# EAGLE design untitled (EAGLE 9.6.1)
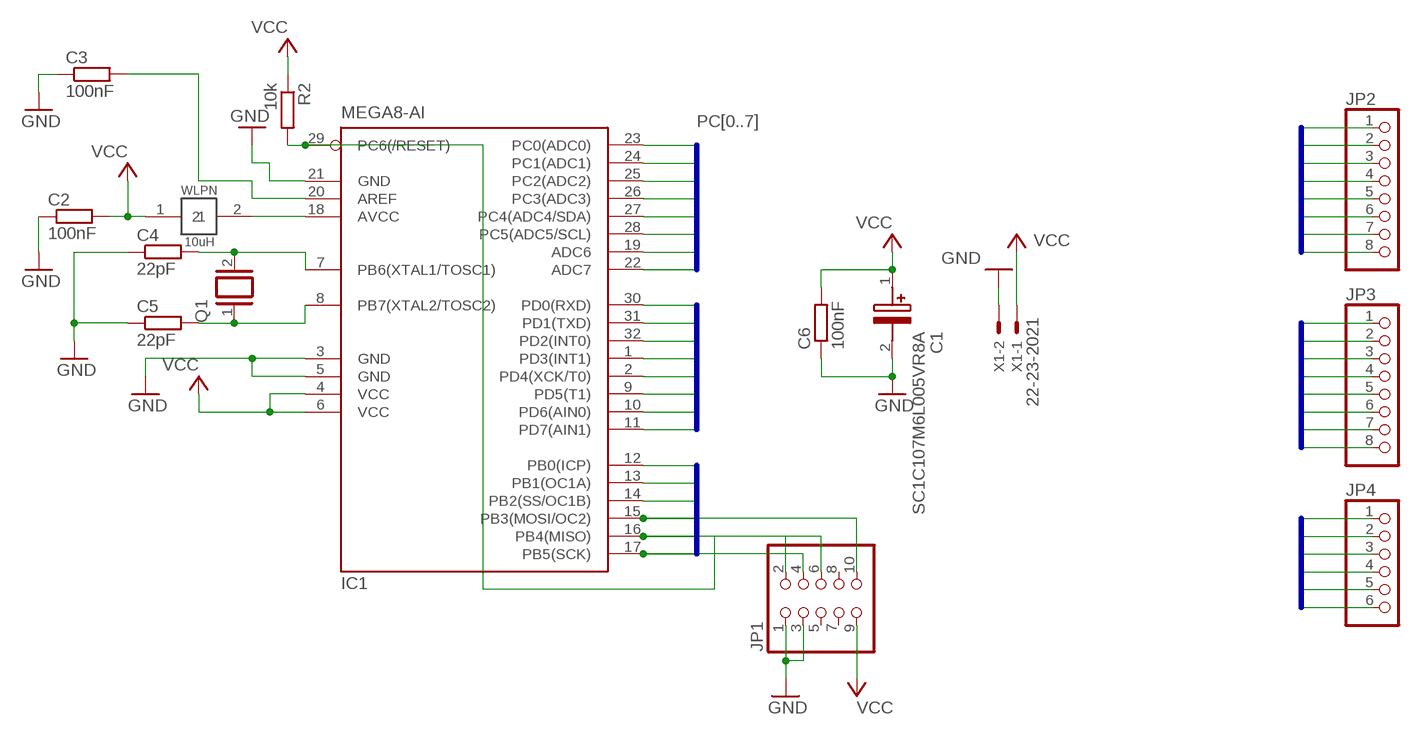
[diagram p0: schematic, sheet 1]

## Parts
C1  SC1C107M6L005VR8A  [CAPAE660X560N]
C2  100nF  R-EU_R0805  [R0805]
C3  100nF  R-EU_R0805  [R0805]
C4  22pF  R-EU_R0805  [R0805]
C5  22pF  R-EU_R0805  [R0805]
C6  100nF  R-EU_R0805  [R0805]
IC1  MEGA8-AI  [TQFP32-08]
JP1  PINHD-2X5  [2X05]
JP2  PINHD-1X8  [1X08]
JP3  PINHD-1X8  [1X08]
JP4  PINHD-1X6  [1X06]
Q1  XTAL/S  [QS]
R2  10k  R-EU_R0805  [R0805]
WLPN  10uH  WLPN303015M100PBSMD  [WLPN303015M100PB]
X1  22-23-2021  [22-23-2021]

## Nets
GND: C1.2(-) C2.1 C3.1 C4.1 C5.1 C6.1 IC1.3(GND) IC1.5(GND) IC1.21(GND) JP1.1 JP1.3 X1.2
N$1: IC1.29(PC6(/RESET)) JP1.6 R2.2
N$2: IC1.18(AVCC) WLPN.2
N$3: C3.2 IC1.20(AREF)
N$4: C4.2 IC1.7(PB6(XTAL1/TOSC1)) Q1.2
N$5: C5.2 IC1.8(PB7(XTAL2/TOSC2)) Q1.1
PB0: IC1.12(PB0(ICP)) JP4.1
PB1: IC1.13(PB1(OC1A)) JP4.2
PB2: IC1.14(PB2(SS/OC1B)) JP4.3
PB3: IC1.15(PB3(MOSI/OC2)) JP1.10 JP4.4
PB4: IC1.16(PB4(MISO)) JP1.2 JP4.5
PB5: IC1.17(PB5(SCK)) JP1.4 JP4.6
PC0: IC1.23(PC0(ADC0)) JP2.1
PC1: IC1.24(PC1(ADC1)) JP2.2
PC2: IC1.25(PC2(ADC2)) JP2.3
PC3: IC1.26(PC3(ADC3)) JP2.4
PC4: IC1.27(PC4(ADC4/SDA)) JP2.5
PC5: IC1.28(PC5(ADC5/SCL)) JP2.6
PC6: IC1.19(ADC6) JP2.7
PC7: IC1.22(ADC7) JP2.8
PD0: IC1.30(PD0(RXD)) JP3.1
PD1: IC1.31(PD1(TXD)) JP3.2
PD2: IC1.32(PD2(INT0)) JP3.3
PD3: IC1.1(PD3(INT1)) JP3.4
PD4: IC1.2(PD4(XCK/T0)) JP3.5
PD5: IC1.9(PD5(T1)) JP3.6
PD6: IC1.10(PD6(AIN0)) JP3.7
PD7: IC1.11(PD7(AIN1)) JP3.8
VCC: C1.1(+) C2.2 C6.2 IC1.4(VCC) IC1.6(VCC) JP1.9 R2.1 WLPN.1 X1.1
Unconnected: JP1.5 JP1.7 JP1.8

## Buses
PC[0..7]
PD[0..7]
PB[0..5]

## Library data of the parts
C1 = SamacSys_Parts:SC1C107M6L005VR8A: SURFACE MOUNT ALUMINUM ELECTROLYTIC CAPACITOR Source: Datasheet <https://store.comet.bg/download-file.php?id=10409>; DESCRIPTION: SURFACE MOUNT ALUMINUM ELECTROLYTIC CAPACITOR; HEIGHT: 5.6mm; MANUFACTURER_NAME: Samwha Capacitor; MANUFACTURER_PART_NUMBER: SC1C107M6L005VR8A
C2-C6 R2 = rcl:R-EU_: RESISTOR, European symbol; SPICEPREFIX: R
IC1 = atmel:MEGA8: MICROCONTROLLER 8 Kbytes FLASH, 1 kbytes SRAM, 512 bytes EEPROM, USART, 6-channel 10 bit ADC, 2-channel 8 bit ADC Pin compatible with Atmega48, ATMega88, ATMega168 Source: avr.lbr; MPN: ATMEGA8-16AU; OC_FARNELL: 9171371; OC_NEWARK: 73M8863
JP1 = pinhead:PINHD-2X5: PIN HEADER
JP2 JP3 = pinhead:PINHD-1X8: PIN HEADER
JP4 = pinhead:PINHD-1X6: PIN HEADER
Q1 = special:XTAL/S: CRYSTAL
WLPN = WLPN303015M100PB:WLPN303015M100PB
X1 = con-molex:22-23-2021: .100" (2.54mm) Center Header - 2 Pin; MF: MOLEX; MPN: 22-23-2021; OC_FARNELL: 1462926; OC_NEWARK: 25C3832

## Board
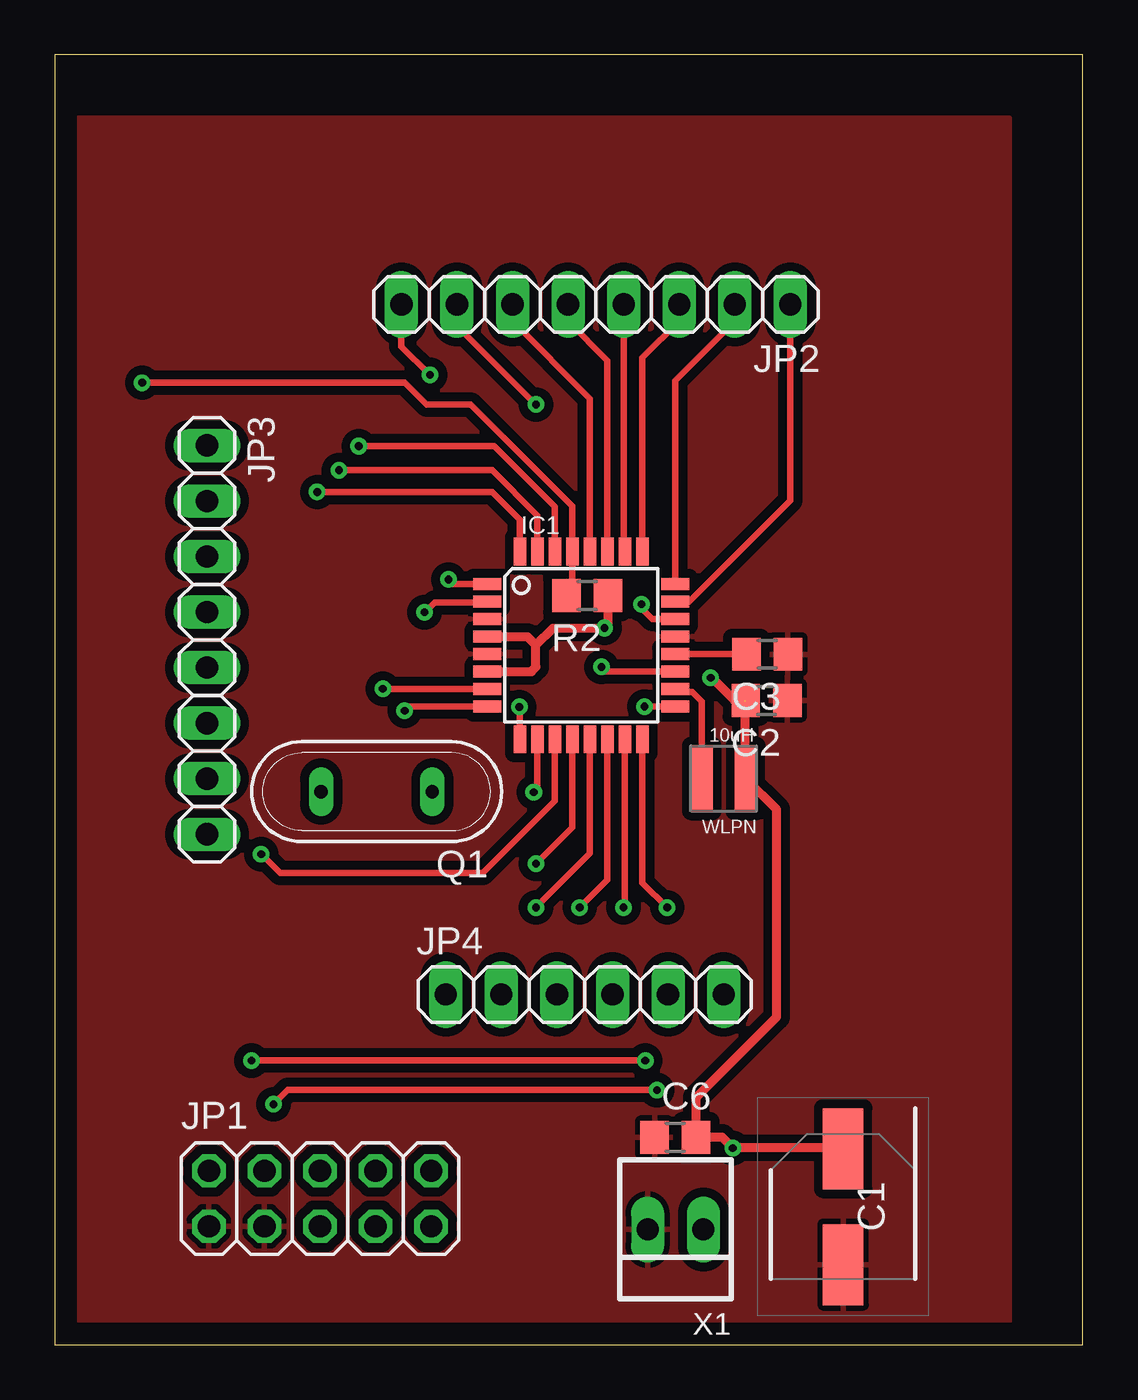
[diagram p1: board, top side]
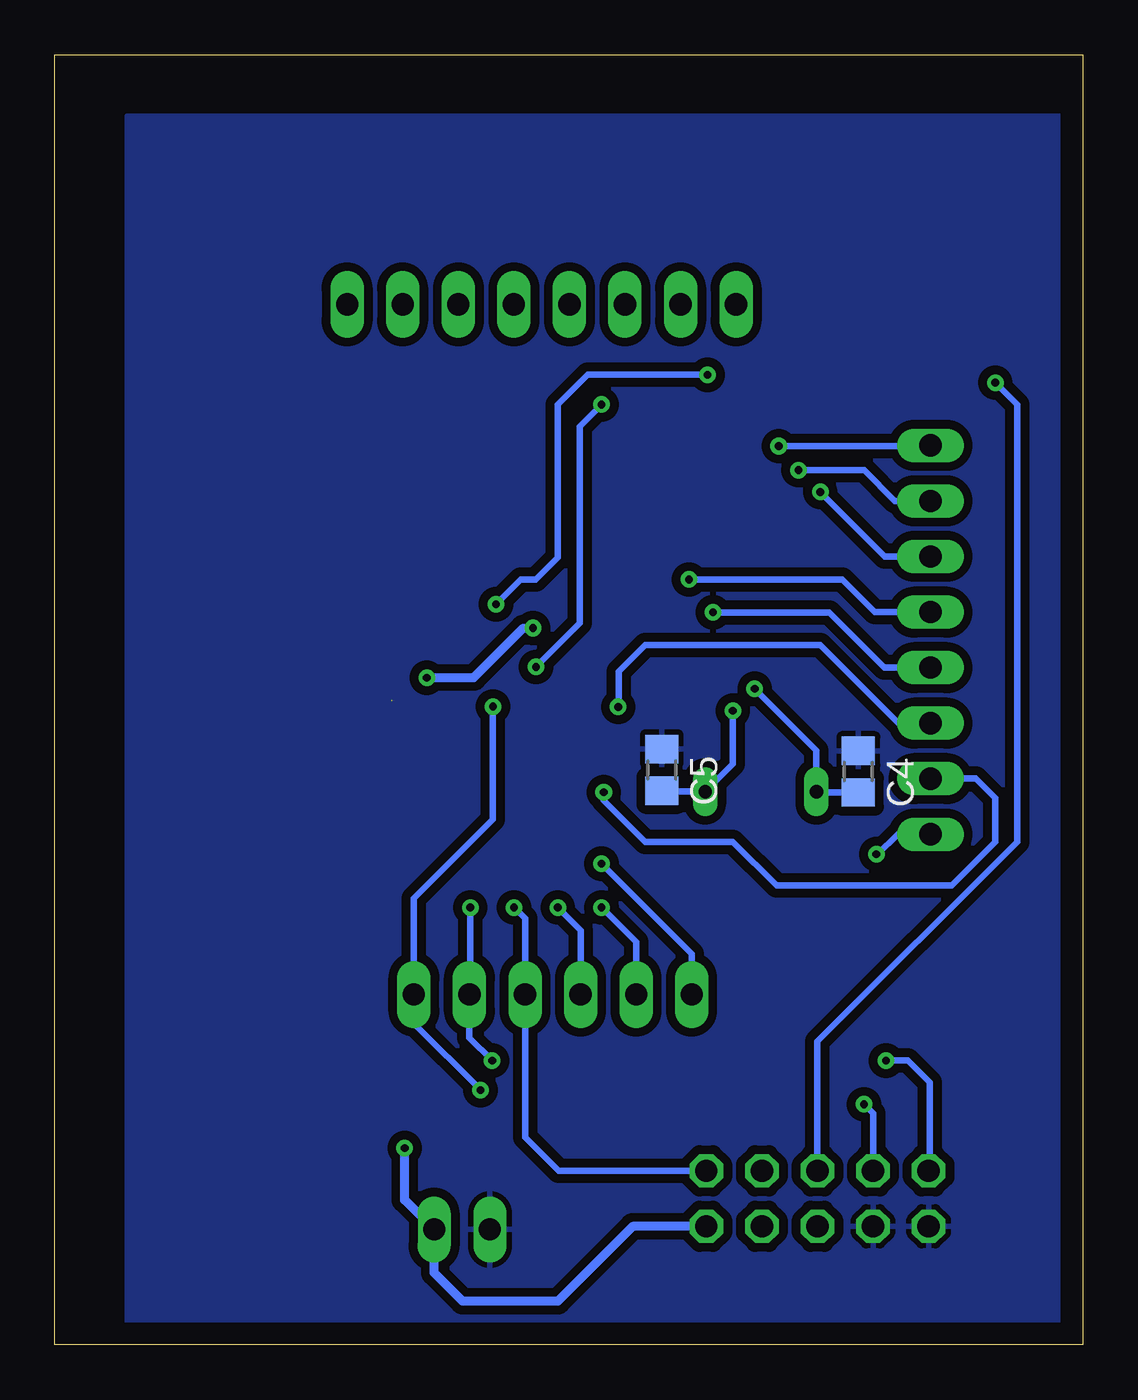
[diagram p2: board, bottom side, seen from below]

Size 47 x 59 mm. Coordinates in mm from the lower left corner, seen from the top.
Outline: 0,0 47,0 47,59 0,59 0,0
Copper layers (1*16): Top 0.035mm / dielectric 1.5mm / Bottom 0.035mm
Design rules "default *": minimum track width 6mil, minimum drill 0.35mm, track to track 9mil, track to pad 9mil, pad to pad 9mil, via to via 9mil, smd to smd 9mil, copper to edge 40mil, drill to drill 6mil, minimum pad ring 10mil, minimum via ring 8mil, stop-mask expansion 4mil, vias tented up to drill 0mil, thermal gap 10mil

### Footprints (pad centres in the part's own frame; a part is rotated, then mirrored left to right if it is on the bottom)
CAPAE660X560N = smd 3.7 x 1.85: 1 -2.65,0; 2 2.65,0
R0805 = smd 1.3 x 1.5: 1 -0.95,0; 2 0.95,0
TQFP32-08 = smd 1.27 x 0.559: 1 -4.293,2.8; 2 -4.293,2; 3 -4.293,1.2; 4 -4.293,0.4; 5 -4.293,-0.4; 6 -4.293,-1.2; 7 -4.293,-2; 8 -4.293,-2.8; 17 4.293,-2.8; 18 4.293,-2; 19 4.293,-1.2; 20 4.293,-0.4; 21 4.293,0.4; 22 4.293,1.2; 23 4.293,2; 24 4.293,2.8 | smd 0.559 x 1.27: 9 -2.8,-4.293; 10 -2,-4.293; 11 -1.2,-4.293; 12 -0.4,-4.293; 13 0.4,-4.293; 14 1.2,-4.293; 15 2,-4.293; 16 2.8,-4.293; 25 2.8,4.293; 26 2,4.293; 27 1.2,4.293; 28 0.4,4.293; 29 -0.4,4.293; 30 -1.2,4.293; 31 -2,4.293; 32 -2.8,4.293
2X05 = drill 1.016 octagon: 1 -5.08,-1.27; 2 -5.08,1.27; 3 -2.54,-1.27; 4 -2.54,1.27; 5 0,-1.27; 6 0,1.27; 7 2.54,-1.27; 8 2.54,1.27; 9 5.08,-1.27; 10 5.08,1.27
1X08 = drill 1.016 long: 1 -8.89,0; 2 -6.35,0; 3 -3.81,0; 4 -1.27,0; 5 1.27,0; 6 3.81,0; 7 6.35,0; 8 8.89,0
1X06 = drill 1.016 long: 1 -6.35,0; 2 -3.81,0; 3 -1.27,0; 4 1.27,0; 5 3.81,0; 6 6.35,0
QS = drill 0.61 long: 1 -2.54,0; 2 2.54,0
WLPN303015M100PB = smd 1 x 3: 1 -1,0; 2 1,0
22-23-2021 = drill 1 long: 1 -1.27,0; 2 1.27,0

### Placement (x,y rotation side)
C1  36.04,6.32 270 top
C2  32.54,29.46 180 top
C3  32.57,31.58 180 top
C4  10.26,26.21 270 bottom
C5  19.25,26.29 270 bottom
C6  28.37,9.49 0 top
IC1  24.07,31.99 0 top
JP1  12.13,6.69 0 top
JP2  24.74,47.58 180 top
JP3  6.96,32.24 270 top
JP4  24.23,16.02 0 top
Q1  14.72,25.3 180 top
R2  24.34,34.26 180 top
WLPN  30.58,25.89 180 top
X1  28.38,5.28 180 top

### Tracks (layer width: path | path; a pad name or v marks a point on that pad's centre or on a via)
GND
  pour Top (isolate 0.406): -0.49,56.12 43.66,56.12 43.66,0.24 -0.49,0.24
  pour Bottom (isolate 0.406): -0.4,0.1 -0.4,56.2 43.7,56.2 43.7,0.1
N$1  (via drill 0.35)
  Top 0.305: R2.2 23.67,34.54 IC1.29 23.67,38.36 19.03,43 17,43 16,44 v4,44
  Bottom 0.305: JP1.6 12.13,13.87 3,23 3,43 v4,44
N$2
  Top 0.305: IC1.18 28.5,29.85 29.16,29.85 29.58,29.43 WLPN.2
N$3
  Top 0.305: IC1.20 C3.2
N$4  (via drill 0.35)
  Top 0.305: v15,30 19.77,30
  Top 0.406: 19.77,30 IC1.7
  Bottom 0.305: C4.2 12.14,25.26 Q1.2 12.18,27.18 v15,30
N$5  (via drill 0.35)
  Top 0.305: v16,29 16.19,29.19 IC1.8
  Top 0.406: IC1.8
  Bottom 0.305: C5.2 19.21,25.3 Q1.1 16,26.56 v16,29
PB0  (via drill 0.35)
  Top 0.305: v22,22 23.67,23.67 IC1.12
  Bottom 0.305: JP4.1 17.88,17.88 v22,22
PB1  (via drill 0.35)
  Top 0.305: v22,20 24.47,22.47 IC1.13
  Bottom 0.305: JP4.2 20.42,18.42 v22,20
PB2  (via drill 0.35)
  Top 0.305: v24,20 25.27,21.27 IC1.14
  Bottom 0.305: JP4.3 22.96,18.96 v24,20
PB3  (via drill 0.35)
  Top 0.305: v26,20 26.07,20.07 IC1.15
  Bottom 0.305: v26,20 25.5,19.5 JP4.4 25.5,9.5 23.96,7.96 JP1.10
PB4  (via drill 0.35)
  Top 0.305: v28,20 26.87,21.13 IC1.16 | v27,13 v9,13
  Bottom 0.305: v28,20 28,16.06 JP4.5 28.04,14.04 v27,13 | v9,13 8,13 7,12 7,8.01 JP1.2
PB5  (via drill 0.35)
  Top 0.305: v26.97,29.19 IC1.17 | v27.53,11.65 10.65,11.65 v10,11
  Bottom 0.305: v26.97,29.19 26.97,24.03 30.58,20.42 JP4.6 30.58,14.7 v27.53,11.65 | v10,11 9.59,10.59 JP1.4
PC0
  Top 0.305: JP2.1 33.63,38.6 29.02,33.99 IC1.23
PC1
  Top 0.305: JP2.2 31.09,46.82 28.36,44.09 IC1.24
PC2
  Top 0.305: JP2.3 28.55,46.82 26.87,45.14 IC1.25
PC3
  Top 0.305: JP2.4 26.01,36.34 IC1.26
PC4
  Top 0.305: JP2.5 23.47,46.82 25.27,45.02 IC1.27
PC5
  Top 0.305: JP2.6 20.93,46.82 24.47,43.28 IC1.28
PC6  (via drill 0.35)
  Top 0.305: IC1.19 25.21,30.79 v25,31 | v22,43 18.39,46.61 JP2.7
  Bottom 0.305: v25,31 23,33 23,42 v22,43
PC7  (via drill 0.35)
  Top 0.305: IC1.22 27.32,33.19 26.82,33.69 v26.82,33.87 | v17.15,44.36 15.85,45.66 JP2.8
  Bottom 0.305: v26.82,33.87 25.69,35 25,35 24,36 24,43 22.64,44.36 v17.15,44.36
PD0  (via drill 0.35)
  Top 0.305: IC1.30 22.87,38.33 20.1,41.1 v13.9,41.1
  Bottom 0.305: v13.9,41.1 6.99,41.1
  Bottom 0.406: JP3.1 6.99,41.1
PD1  (via drill 0.35)
  Top 0.305: IC1.31 22.07,37.93 20,40 v13,40
  Bottom 0.305: v13,40 10,40 8.59,38.59 JP3.2
PD2  (via drill 0.35)
  Top 0.305: IC1.32 21.27,37.73 20,39 v12,39
  Bottom 0.305: v12,39 9.05,36.05 JP3.3
PD3  (via drill 0.35)
  Top 0.305: v18,35 18.2,34.8 19.77,34.8 IC1.1
  Bottom 0.305: JP3.4 9.51,33.51 11,35 v18,35
PD4  (via drill 0.35)
  Top 0.305: IC1.2 19.74,33.95 17.39,33.95 16.93,33.5 v16.9,33.5
  Bottom 0.305: JP3.5 9.07,30.97 11.6,33.5 v16.9,33.5
PD5  (via drill 0.35)
  Top 0.305: v21.24,29.17 21.26,29.17 IC1.9
  Bottom 0.305: JP3.6 8.43,28.43 12,32 20,32 21.21,30.79 21.21,29.2 v21.24,29.17
PD6  (via drill 0.35)
  Top 0.305: v21.9,25.27 22.07,25.44 IC1.10
  Bottom 0.305: JP3.7 4.89,25.89 4,25 4,23 6,21 14,21 16,23 20,23 21.9,24.9 v21.9,25.27
PD7  (via drill 0.35)
  Top 0.305: v9.44,22.44 10.31,21.57 19.57,21.57 22.87,24.87 IC1.11
  Bottom 0.305: JP3.8 8.47,23.35 9.4,22.42 9.42,22.42 v9.44,22.44
VCC  (via drill 0.35)  (1 unrouted)
  Top 0.406: C2.2 WLPN.1 33,24.47 33,15 29.32,11.32 C6.2 30.51,9.49 v31,9 36.01,9 | C2.2 31.09,29.46 30.04,30.51 | R2.1 25.29,32.93 v25.14,32.78 22.78,32.78 22,32 | IC1.6 21.79,30.79 22,31 22,32 | IC1.4 21.61,32.39 22,32
  Top 0.61: C1.1 36.01,9 | 30.04,30.51 v29.99,30.51
  Bottom 0.406: v31,9 31,6.63 X1.1 29.65,3.3 28.35,2 24,2 20.58,5.42 JP1.9 | v29.99,30.51 27.85,30.51 25.58,32.78 v25.14,32.78